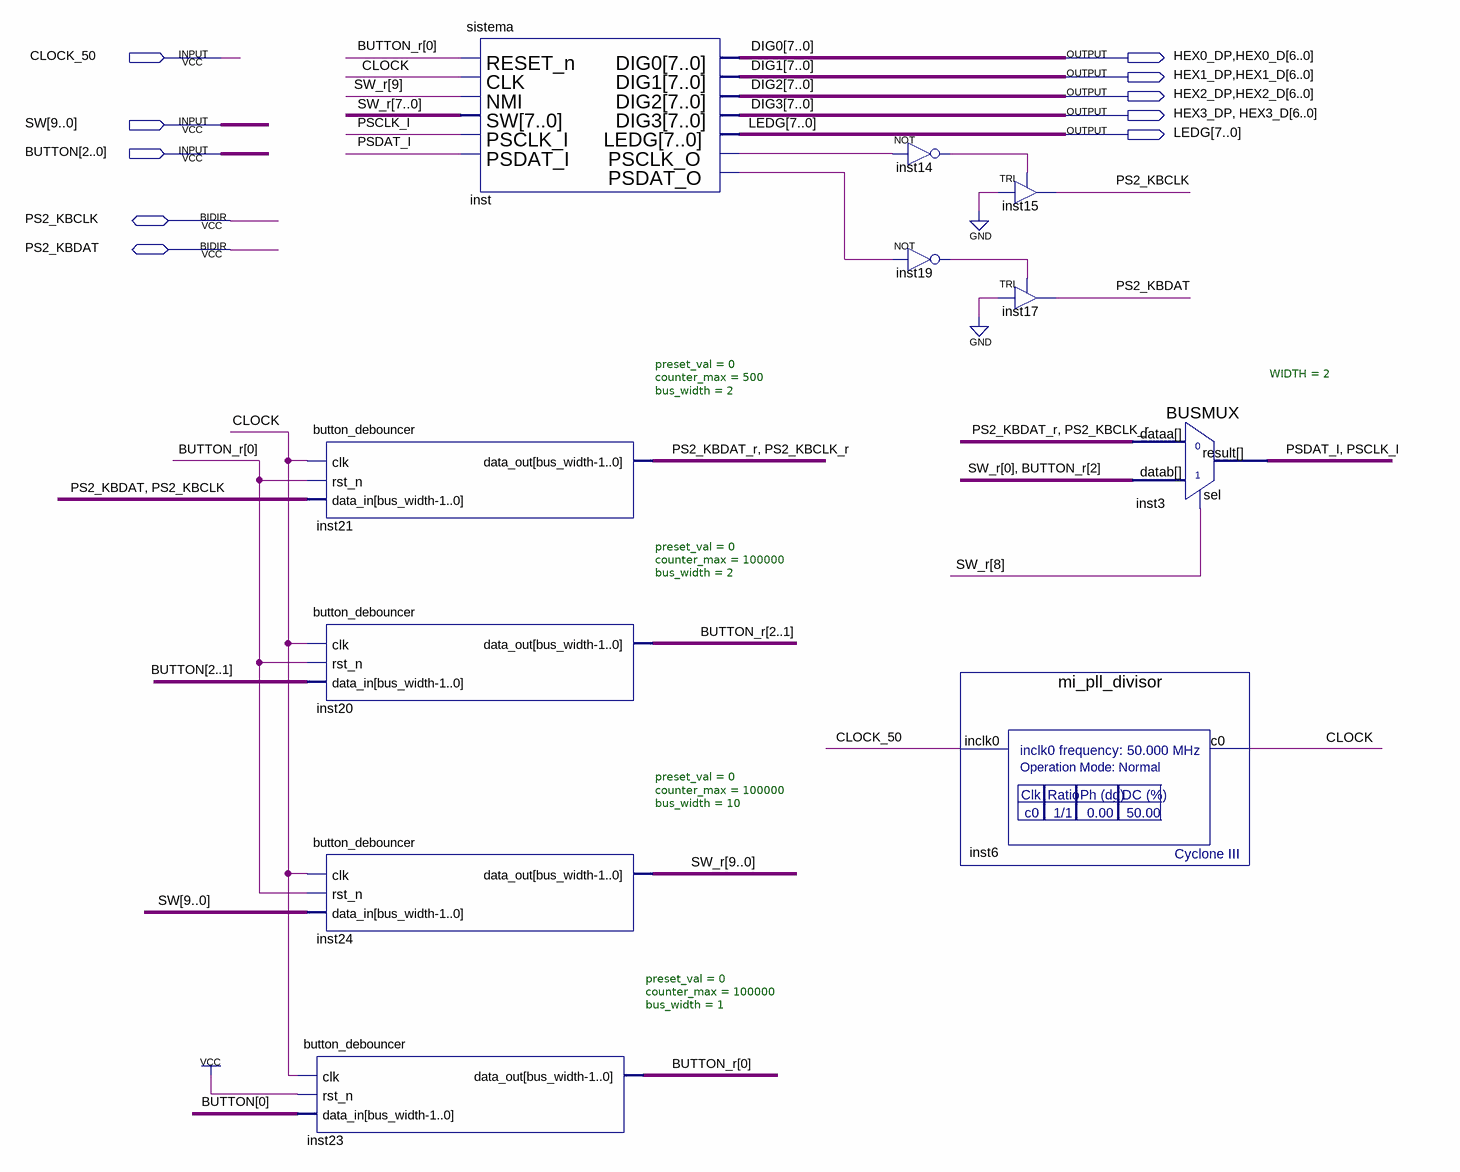
[diagram p0: schematic sheet]
// Quartus schematic sistema_top.bdf as structural Verilog: 11 symbols, 10 pins
module sistema_top (
  input  CLOCK_50,
  input  [9:0] SW,
  input  [2:0] BUTTON,
  inout  PS2_KBCLK,
  inout  PS2_KBDAT,
  output HEX0_DP,
  output [6:0] HEX0_D,
  output HEX1_DP,
  output [6:0] HEX1_D,
  output HEX2_DP,
  output [6:0] HEX2_D,
  output HEX3_DP,
  output [6:0] HEX3_D,
  output [7:0] LEDG
);

  wire CLOCK, inst14_out, inst19_out, inst_psclk_o, inst_psdat_o, PS2_KBCLK_r, PS2_KBDAT_r, PSCLK_I, PSDAT_I;
  wire [2:0] BUTTON_r;
  wire [9:0] SW_r;

  button_debouncer #(.preset_val(0), .counter_max(500), .bus_width(2)) inst21 (
    .clk(CLOCK), .rst_n(BUTTON_r[0]), .data_in({PS2_KBDAT, PS2_KBCLK}), .data_out({PS2_KBDAT_r, PS2_KBCLK_r}));
  button_debouncer #(.preset_val(0), .counter_max(100000), .bus_width(2)) inst20 (
    .clk(CLOCK), .rst_n(BUTTON_r[0]), .data_in(BUTTON[2:1]), .data_out(BUTTON_r[2:1]));
  button_debouncer #(.preset_val(0), .counter_max(100000), .bus_width(10)) inst24 (
    .clk(CLOCK), .rst_n(BUTTON_r[0]), .data_in(SW), .data_out(SW_r));
  button_debouncer #(.preset_val(0), .counter_max(100000), .bus_width(1)) inst23 (
    .clk(CLOCK), .rst_n(1'b1), .data_in(BUTTON[0]), .data_out(BUTTON_r[0]));
  sistema inst (
    .RESET_n(BUTTON_r[0]), .CLK(CLOCK), .NMI(SW_r[9]), .SW(SW_r[7:0]), .PSCLK_I(PSCLK_I), .PSDAT_I(PSDAT_I),
    .DIG0({HEX0_DP, HEX0_D}), .DIG1({HEX1_DP, HEX1_D}), .DIG2({HEX2_DP, HEX2_D}), .DIG3({HEX3_DP, HEX3_D}),
    .LEDG(LEDG), .PSCLK_O(inst_psclk_o), .PSDAT_O(inst_psdat_o));
  not inst14 (inst14_out, inst_psclk_o);
  not inst19 (inst19_out, inst_psdat_o);
  mi_pll_divisor inst6 (.inclk0(CLOCK_50), .c0(CLOCK));
  TRI inst15 (.IN(1'b0), .OE(inst14_out), .OUT(PS2_KBCLK));
  TRI inst17 (.IN(1'b0), .OE(inst19_out), .OUT(PS2_KBDAT));
  BUSMUX #(.WIDTH(2)) inst3 (
    .datab({SW_r[0], BUTTON_r[2]}), .sel(SW_r[8]), .dataa({PS2_KBDAT_r, PS2_KBCLK_r}),
    .result({PSDAT_I, PSCLK_I}));

  // Other names for the same wires on the sheet: DIG0[7:0] = {HEX0_DP, HEX0_D}; DIG1[7:0] = {HEX1_DP, HEX1_D};
  //   DIG2[7:0] = {HEX2_DP, HEX2_D}; DIG3[7:0] = {HEX3_DP, HEX3_D}
endmodule
